# Altium schematic sheet Shift register map.SchDoc
size A4; SheetNumber: 5; SheetTotal: 5
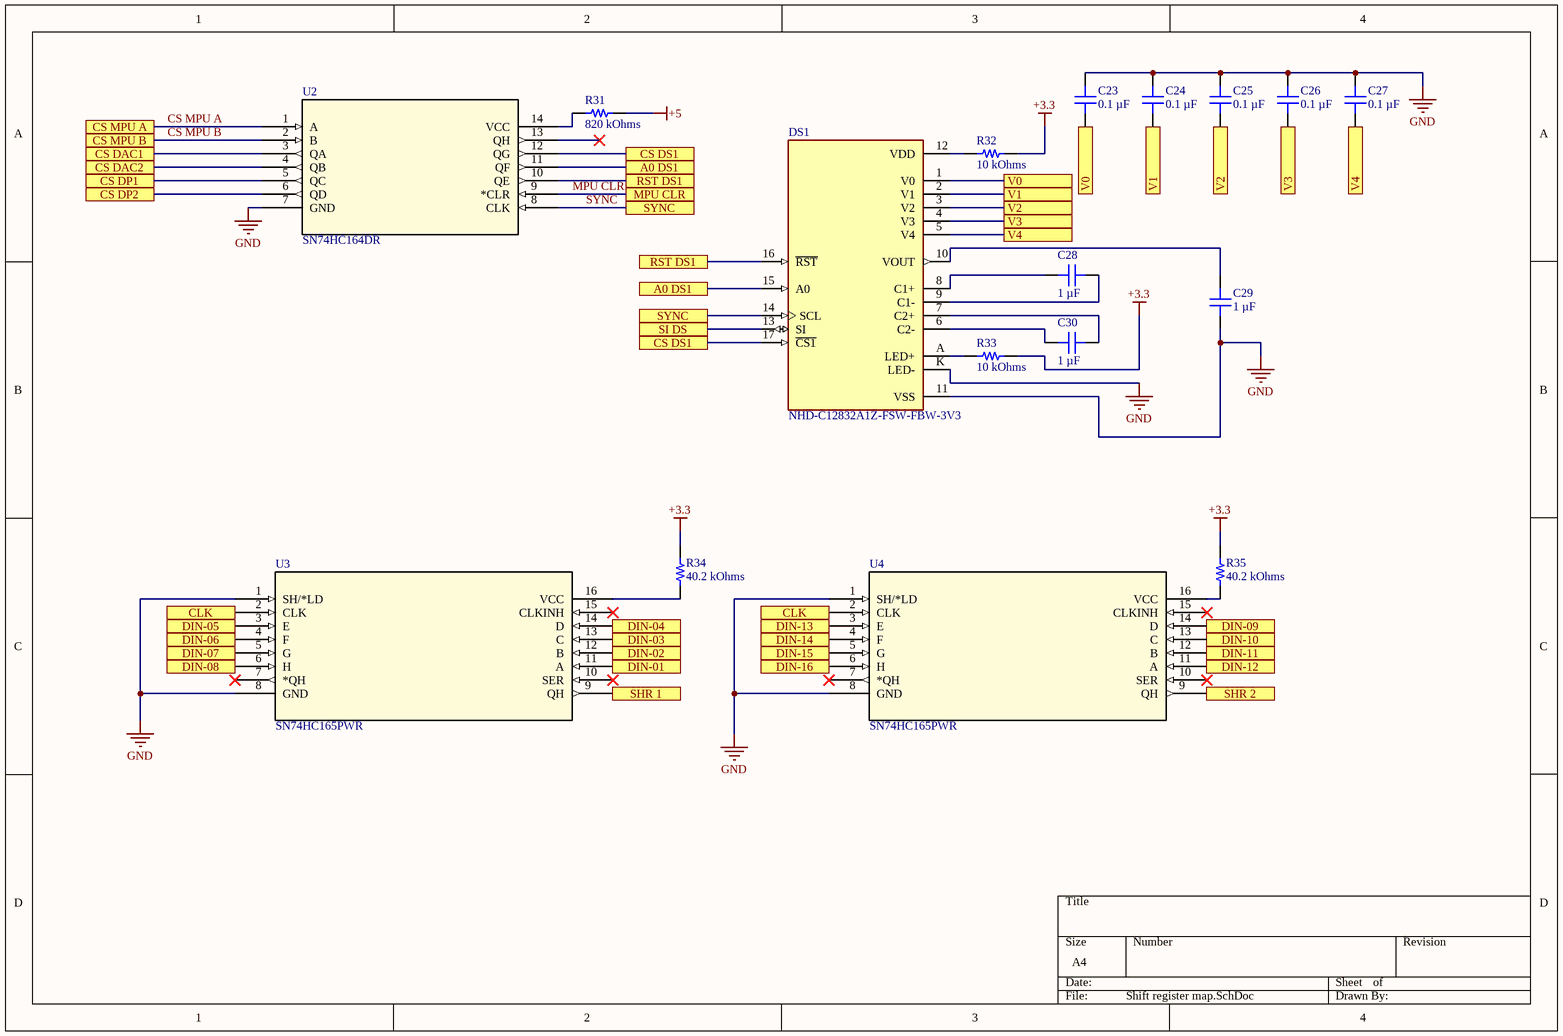
[diagram p0: Shift register map.SchDoc]

## Parts
C23  0.1 µF  [CAP 1210_3225 - 1MM]
C24  0.1 µF  [CAP 1210_3225 - 1MM]
C25  0.1 µF  [CAP 1210_3225 - 1MM]
C26  0.1 µF  [CAP 1210_3225 - 1MM]
C27  0.1 µF  [CAP 1210_3225 - 1MM]
C28  1 µF  [CAP 1210_3225 - 1MM]
C29  1 µF  [CAP 1210_3225 - 1MM]
C30  1 µF  [CAP 1210_3225 - 1MM]
DS1  NHD-C12832A1Z-FSW-FBW-3V3  [LCD_NHD-C12832A1Z-FSW-FBW-3V3]
R31  820 kOhms  [RES 1210_3225]
R32  10 kOhms  [RES 1210_3225]
R33  10 kOhms  [RES 1210_3225]
R34  40.2 kOhms  [RES 1206_3216]
R35  40.2 kOhms  [RES 1206_3216]
U2  SN74HC164DR  [SOP14]
U3  SN74HC165PWR  [PW16]
U4  SN74HC165PWR  [PW16]

## Ports
A0 DS1, CLK, CS DAC1, CS DAC2, CS DP1, CS DP2, CS DS1, CS MPU A, CS MPU B, DIN-01, DIN-02, DIN-03, DIN-04, DIN-05, DIN-06, DIN-07, DIN-08, DIN-09, DIN-10, DIN-11, DIN-12, DIN-13, DIN-14, DIN-15, DIN-16, MPU CLR, RST DS1, SHR 1, SHR 2, SI DS, SYNC, V0, V1, V2, V3, V4

## Nets
+3.3: R32.2 R33.2 R34.2 R35.2
+5: R31.2
GND: C23.2 C24.2 C25.2 C26.2 C27.2 C29.1 DS1.11(VSS) DS1.K(LED-) U2.7(GND) U3.1(SH/*LD) U3.8(GND) U4.1(SH/*LD) U4.8(GND)
A0 DS1: DS1.15(A0) U2.11(QF) ; port A0 DS1
CLK: U3.2(CLK) U4.2(CLK) ; port CLK
CS DAC1: U2.3(QA) ; port CS DAC1
CS DAC2: U2.4(QB) ; port CS DAC2
CS DP1: U2.5(QC) ; port CS DP1
CS DP2: U2.6(QD) ; port CS DP2
CS DS1: DS1.17(~{CS1}) U2.12(QG) ; port CS DS1
CS MPU A: U2.1(A) ; port CS MPU A
CS MPU B: U2.2(B) ; port CS MPU B
DIN-01: U3.11(A) ; port DIN-01
DIN-02: U3.12(B) ; port DIN-02
DIN-03: U3.13(C) ; port DIN-03
DIN-04: U3.14(D) ; port DIN-04
DIN-05: U3.3(E) ; port DIN-05
DIN-06: U3.4(F) ; port DIN-06
DIN-07: U3.5(G) ; port DIN-07
DIN-08: U3.6(H) ; port DIN-08
DIN-09: U4.14(D) ; port DIN-09
DIN-10: U4.13(C) ; port DIN-10
DIN-11: U4.12(B) ; port DIN-11
DIN-12: U4.11(A) ; port DIN-12
DIN-13: U4.3(E) ; port DIN-13
DIN-14: U4.4(F) ; port DIN-14
DIN-15: U4.5(G) ; port DIN-15
DIN-16: U4.6(H) ; port DIN-16
MPU CLR: U2.9(*CLR) ; port MPU CLR
RST DS1: DS1.16(~{RST}) U2.10(QE) ; port RST DS1
SHR 1: U3.9(QH) ; port SHR 1
SHR 2: U4.9(QH) ; port SHR 2
SI DS: DS1.13(SI) ; port SI DS
SYNC: DS1.14(SCL) U2.8(CLK) ; port SYNC
V0: C23.1 DS1.1(V0) ; port V0
V1: C24.1 DS1.2(V1) ; port V1
V2: C25.1 DS1.3(V2) ; port V2
V3: C26.1 DS1.4(V3) ; port V3
V4: C27.1 DS1.5(V4) ; port V4
NetC28_1: C28.1 DS1.8(C1+)
NetC28_2: C28.2 DS1.9(C1-)
NetC29_2: C29.2 DS1.10(VOUT)
NetC30_1: C30.1 DS1.6(C2-)
NetC30_2: C30.2 DS1.7(C2+)
NetDS1_12: DS1.12(VDD) R32.1
NetDS1_A: DS1.A(LED+) R33.1
NetR31_1: R31.1 U2.14(VCC)
NetR34_1: R34.1 U3.16(VCC)
NetR35_1: R35.1 U4.16(VCC)

Not connected (* = marked no-connect by the designer): U2 13(QH)*; U3 7(*QH)* 10(SER)* 15(CLKINH)*; U4 7(*QH)* 10(SER)* 15(CLKINH)*

## Library data of the parts
C23-C27 = GMC32X7R104K100NT: CAP1210 X7R .1UF 10% 100V; manufacturer: Cal-Chip Electronics, Inc.; Part Number: GMC32X7R104K100NT; Value: 0.1 µF; Applications: General Purpose; Capacitance: 0.1 µF; componentlink1description: Datasheet; componentlink1url: https://calchip.com/wp-content/uploads/2023/05/gmc_series.pdf; componentlink2description: DigiKey Link; componentlink2url: https://www.digikey.com/en/products/detail/cal-chip-electronics-inc/GMC32X7R104K100NT/21802075; Device Package: 1210 (3225 Metric); lastupdated: 4/06/2024 7:20:42 PM; Lifecycle Status: Active; Minimum Order: 1; Mounting Type: Surface Mount, MLCC; Operating Temperature: -55°C ~ 125°C; Package / Case: 1210 (3225 Metric); packaging: TapeAndReel; partid: 58440; price: 0.05; series: GMC; Size / Dimension: 0.126" L x 0.098" W (3.20mm x 2.50mm); Supplier 1: DigiKey; Supplier Part Number 1: 4713-GMC32X7R104K100NTCT-ND; Temperature Coefficient: X7R; Thickness (Max): 0.087" (2.20mm); Tolerance: ±10%; Voltage - Rated: 100V
C28-C30 = GMC32X7R105K25NT: CAP1210 X7R 1UF 10% 25V; manufacturer: Cal-Chip Electronics, Inc.; Part Number: GMC32X7R105K25NT; Value: 1 µF; Applications: General Purpose; Capacitance: 1 µF; componentlink1description: Datasheet; componentlink1url: https://88ce57.p3cdn1.secureserver.net/wp-content/uploads/2023/01/gmc_series-2.pdf; componentlink2description: DigiKey Link; componentlink2url: https://www.digikey.com/en/products/detail/cal-chip-electronics-inc/GMC32X7R105K25NT/19910714; Device Package: 1210 (3225 Metric); lastupdated: 4/06/2024 7:20:43 PM; Lifecycle Status: Active; Minimum Order: 1; Mounting Type: Surface Mount, MLCC; Operating Temperature: -55°C ~ 125°C; Package / Case: 1210 (3225 Metric); packaging: TapeAndReel; partid: 56654; price: 0.06; series: GMC; Size / Dimension: 0.126" L x 0.098" W (3.20mm x 2.50mm); Supplier 1: DigiKey; Supplier Part Number 1: 4713-GMC32X7R105K25NTCT-ND; Temperature Coefficient: X7R; Thickness (Max): 0.071" (1.80mm); Tolerance: ±10%; Voltage - Rated: 25V
DS1 = NHD-C12832A1Z-FSW-FBW-3V3: Graphic LCD Display Module Transflective Black (White - Inverted) FSTN - Film Super-Twisted Nematic SPI 128 x 32; MF: Newhaven; Package: None; Purchase-URL: https://pricing.snapeda.com/search/part/NHD-C12832A1Z-FSW-FBW-3V3/?ref=eda; Price: None; Availability: Good; Check_prices: https://www.snapeda.com/parts/NHD-C12832A1Z-FSW-FBW-3V3/Newhaven%20Display%20Intl/view-part/275499/?ref=eda; MP: NHD-C12832A1Z-FSW-FBW-3V3; SnapEDA_Link: https://www.snapeda.com/parts/NHD-C12832A1Z-FSW-FBW-3V3/Newhaven%20Display%20Intl/view-part/275499/?ref=snap; Value: *
R31 = RMCF1210JT820K: RES 820K OHM 5% 1/3W 1210; Manufacturer: Stackpole Electronics Inc; Power (Watts): 0.333W, 1/3W; Temperature Coefficient: ±200ppm/°C; Part Number: RMCF1210JT820K; ComponentLink1Description: Datasheet; ComponentLink1URL: https://www.seielect.com/catalog/sei-rmcf_rmcp.pdf; ComponentLink2Description: DigiKey Link; ComponentLink2URL: https://www.digikey.com/en/products/detail/stackpole-electronics-inc/RMCF1210JT820K/1757292; Composition: Thick Film; Device Package: 1210 (3225 Metric); Features: Automotive AEC-Q200; Height - Seated (Max): 0.028" (0.70mm); LastUpdated: 3/06/2024 8:18:51 PM; Lifecycle Status: Active; Minimum Order: 1; Number of Terminations: 2; Operating Temperature: -55°C ~ 155°C; Package / Case: 1210 (3225 Metric); Packaging: TapeAndReel; Part Status: Active; Price: 0.02; Ratings: AEC-Q200; Resistance: 820 kOhms; Series: RMCF; Size / Dimension: 0.126" L x 0.098" W (3.20mm x 2.50mm); Supplier 1: DigiKey; Supplier Part Number 1: RMCF1210JT820KCT-ND; Supplier Device Package: 1210; Tolerance: ±5%; Value: 820 kOhms
R32 R33 = TNPW121010K0BEEN: RES 10K OHM 0.1% 1/2W 1210; Manufacturer: Vishay Dale; Power (Watts): 0.5W, 1/2W; Temperature Coefficient: ±25ppm/°C; Part Number: TNPW121010K0BEEN; ComponentLink1Description: Datasheet; ComponentLink1URL: http://www.vishay.com/docs/28758/tnpw_e3.pdf; ComponentLink2Description: DigiKey Link; ComponentLink2URL: https://www.digikey.com/en/products/detail/vishay-dale/TNPW121010K0BEEN/1611704; Composition: Thin Film; Device Package: 1210 (3225 Metric); Features: Anti-Sulfur, Automotive AEC-Q200, Moisture Resistant; Height - Seated (Max): 0.030" (0.75mm); LastUpdated: 3/06/2024 8:18:52 PM; Lifecycle Status: Active; Minimum Order: 1; Number of Terminations: 2; Operating Temperature: -55°C ~ 155°C; Package / Case: 1210 (3225 Metric); Packaging: TapeAndReel; Part Status: Active; Price: 0.91; Ratings: AEC-Q200; Resistance: 10 kOhms; Series: TNPW e3; Size / Dimension: 0.126" L x 0.096" W (3.20mm x 2.45mm); Supplier 1: DigiKey; Supplier Part Number 1: 541-TNPW121010K0BEENCT-ND; Supplier Device Package: 1210; Tolerance: ±0.1%; Value: 10 kOhms
R34 R35 = RMCF1206FT40K2: RES 40.2K OHM 1% 1/4W 1206; Manufacturer: Stackpole Electronics Inc; Power (Watts): 0.25W, 1/4W; Temperature Coefficient: ±100ppm/°C; Part Number: RMCF1206FT40K2; ComponentLink1Description: Datasheet; ComponentLink1URL: https://www.seielect.com/catalog/sei-rmcf_rmcp.pdf; ComponentLink2Description: DigiKey Link; ComponentLink2URL: https://www.digikey.com/en/products/detail/stackpole-electronics-inc/RMCF1206FT40K2/1754014; Composition: Thick Film; Device Package: 1206 (3216 Metric); Features: Automotive AEC-Q200; Height - Seated (Max): 0.028" (0.70mm); LastUpdated: 9/02/2024 8:54:45 PM; Lifecycle Status: Active; Minimum Order: 1; Number of Terminations: 2; Operating Temperature: -55°C ~ 155°C; Package / Case: 1206 (3216 Metric); Packaging: TapeAndReel; PartId: 26907; Part Status: Active; Price: 0.01; Ratings: AEC-Q200; Resistance: 40.2 kOhms; Series: RMCF; Size / Dimension: 0.126" L x 0.063" W (3.20mm x 1.60mm); Supplier 1: DigiKey; Supplier Part Number 1: RMCF1206FT40K2CT-ND; Supplier Device Package: 1206; Tolerance: ±1%; Value: 40.2 kOhms
U2 = SN74HC164DR: No Description Available; Mfr_Name: Texas Instruments; RefDes: RefDes; Type: Type
U3 U4 = SN74HC165PWR: No Description Available; Mfr_Name: Texas Instruments; RefDes: RefDes; Type: Type